# EAGLE board mainboard (EAGLE 7.4.0), part 1 of 2
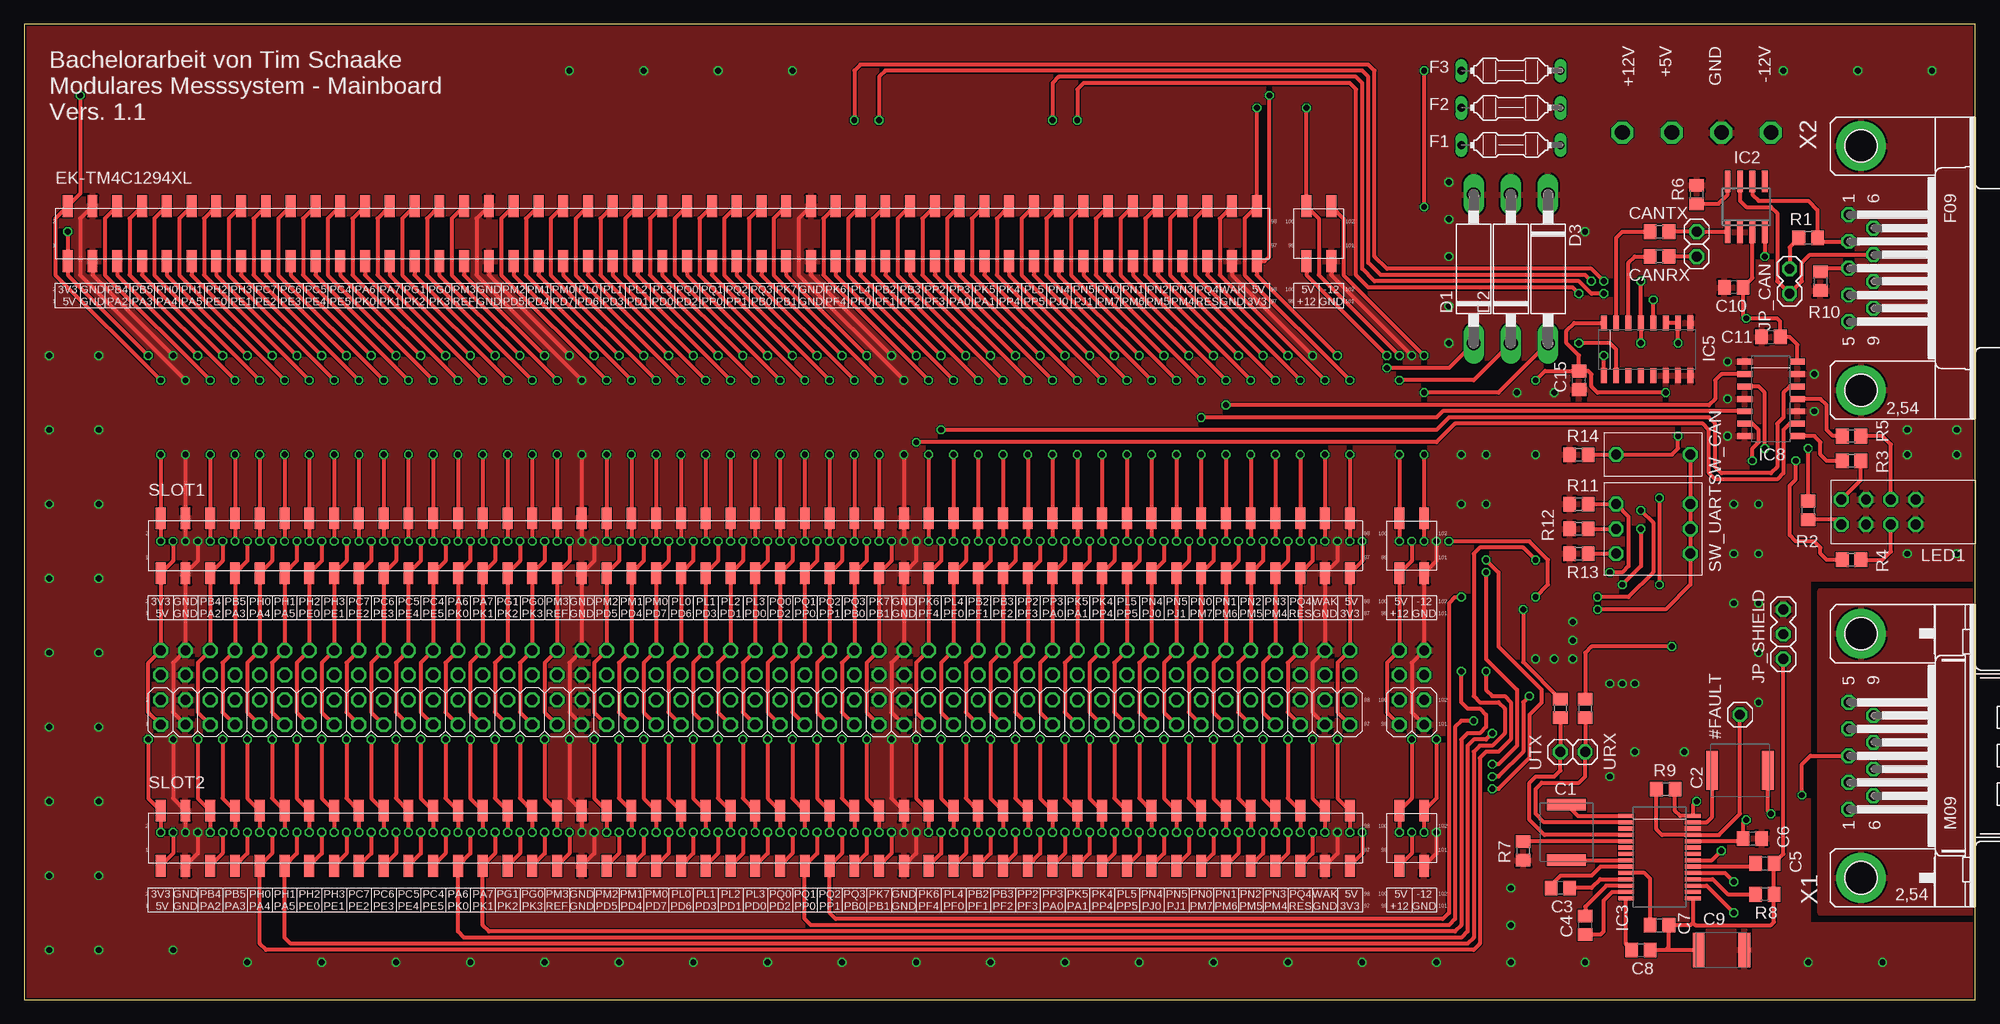
[diagram p5: board, top side]
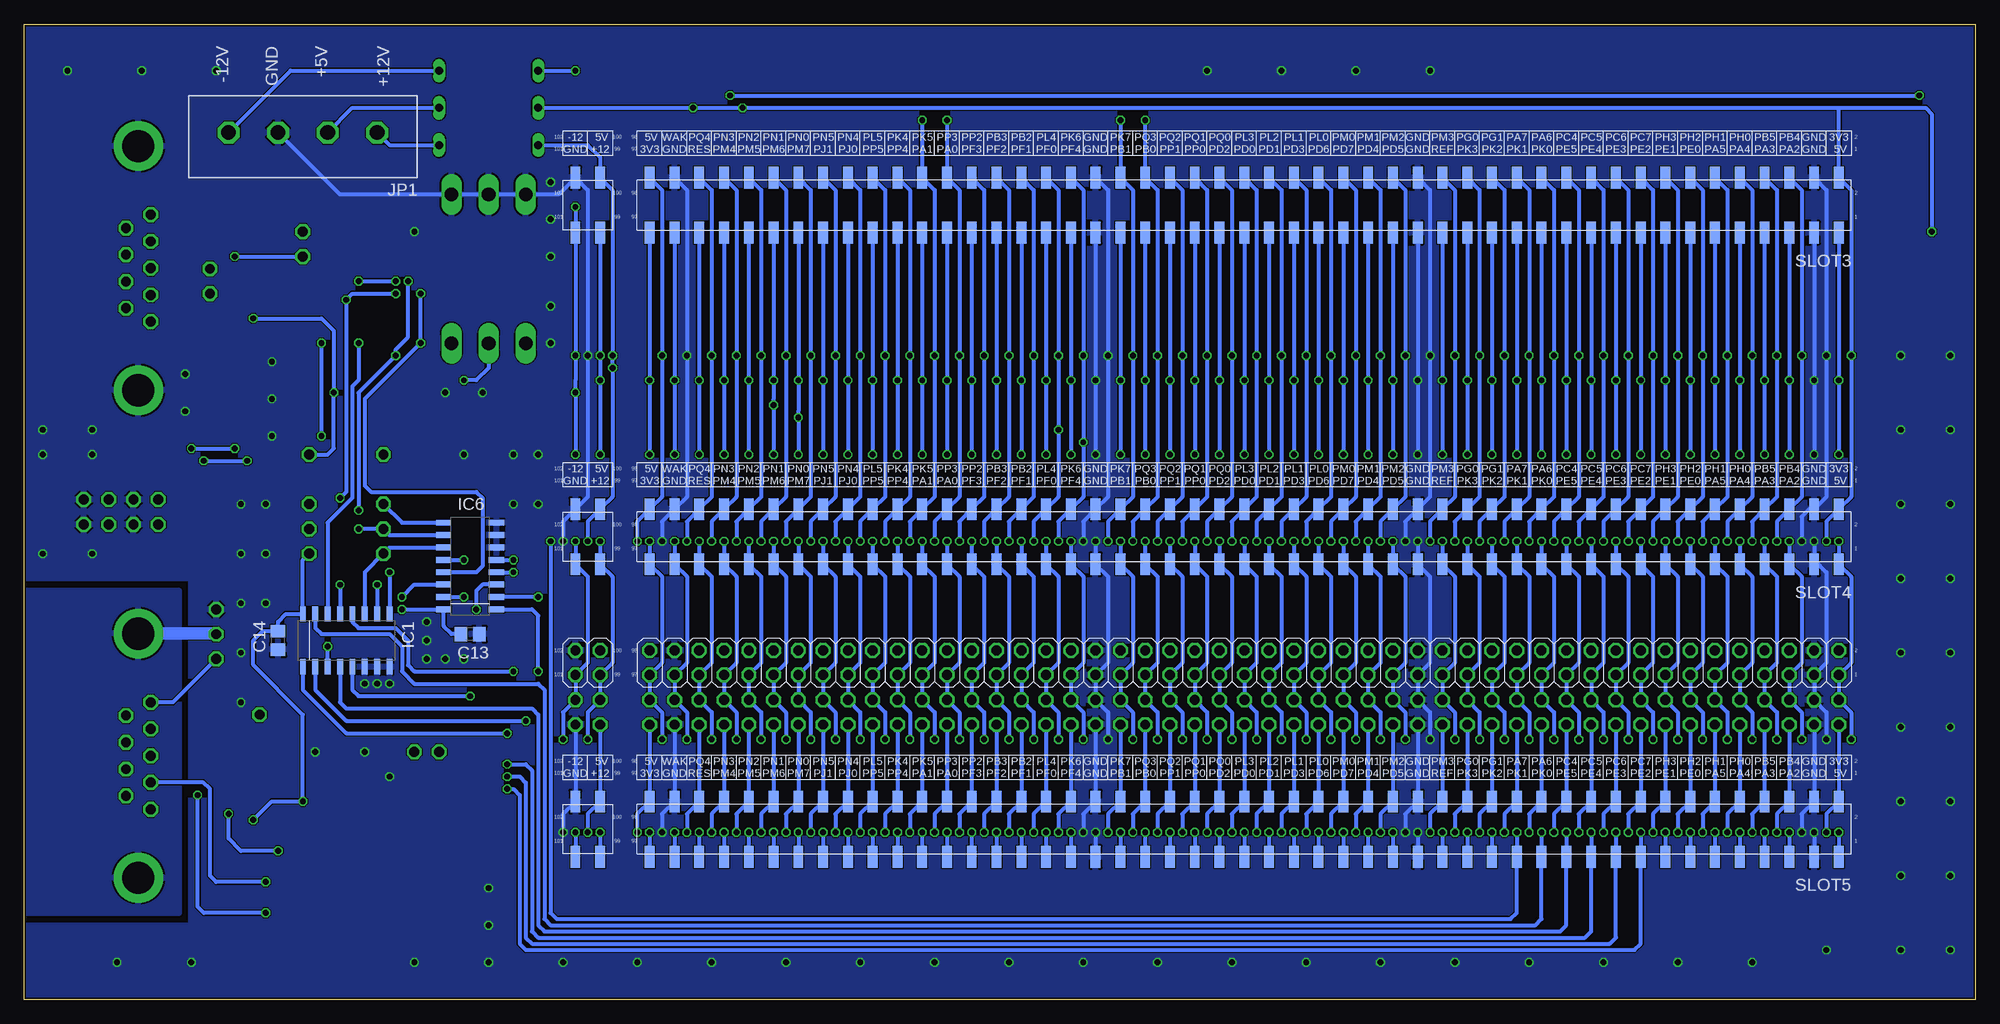
[diagram p6: board, bottom side, seen from below]

Size 200 x 100 mm. Coordinates in mm from the lower left corner, seen from the top.
Outline: 0,0 200,0 200,100 0,100 0,0
Copper layers (1*16): Top 0.018mm / dielectric 1.55mm / Bottom 0.018mm
Design rules "Multi-CB_2L_125um-Tracks_OL35um": minimum track width 0.125mm, minimum drill 0.2mm, track to track 0.125mm, track to pad 0.125mm, pad to pad 0.125mm, via to via 0.125mm, smd to smd 0mil, copper to edge 0.2mm, drill to drill 0.2mm, minimum pad ring 0.125mm, minimum via ring 0.125mm, stop-mask expansion 2mil, vias tented up to drill 0.45mm, thermal gap 0.2mm

## Footprints (pad centres in the part's own frame; a part is rotated, then mirrored left to right if it is on the bottom)
1X1 = drill 1.016 octagon: 1 0,0
C2220 = smd 1.2 x 4: 1 -2.85,0; 2 2.85,0
C0805 = smd 1.3 x 1.5: 1 -0.95,0; 2 0.95,0
C1812 = smd 1.2 x 3.5: 1 -2.35,0; 2 2.35,0
C1702-15 = drill 1.397 long: A 7.62,0; C -7.62,0
EK-TM4C1294XL_BB+SMD = smd 1.016 x 2.223: 1 -60.96,-2.826; 2 -60.96,2.826; 3 -58.42,-2.826; 4 -58.42,2.826; 5 -55.88,-2.826; 6 -55.88,2.826; 7 -53.34,-2.826; 8 -53.34,2.826; 9 -50.8,-2.826; 10 -50.8,2.826; 11 -48.26,-2.826; 12 -48.26,2.826; 13 -45.72,-2.826; 14 -45.72,2.826; 15 -43.18,-2.826; 16 -43.18,2.826; 17 -40.64,-2.826; 18 -40.64,2.826; 19 -38.1,-2.826; 20 -38.1,2.826; 21 -35.56,-2.826; 22 -35.56,2.826; 23 -33.02,-2.826; 24 -33.02,2.826; 25 -30.48,-2.826; 26 -30.48,2.826; 27 -27.94,-2.826; 28 -27.94,2.826; 29 -25.4,-2.826; 30 -25.4,2.826; 31 -22.86,-2.826; 32 -22.86,2.826; 33 -20.32,-2.826; 34 -20.32,2.826; 35 -17.78,-2.826; 36 -17.78,2.826; 37 -15.24,-2.826; 38 -15.24,2.826; 39 -12.7,-2.826; 40 -12.7,2.826; 41 -10.16,-2.826; 42 -10.16,2.826; 43 -7.62,-2.826; 44 -7.62,2.826; 45 -5.08,-2.826; 46 -5.08,2.826; 47 -2.54,-2.826; 48 -2.54,2.826; 49 0,-2.826; 50 0,2.826; 51 2.54,-2.826; 52 2.54,2.826; 53 5.08,-2.826; 54 5.08,2.826; 55 7.62,-2.826; 56 7.62,2.826; 57 10.16,-2.826; 58 10.16,2.826; 59 12.7,-2.826; 60 12.7,2.826; 61 15.24,-2.826; 62 15.24,2.826; 63 17.78,-2.826; 64 17.78,2.826; 65 20.32,-2.826; 66 20.32,2.826; 67 22.86,-2.826; 68 22.86,2.826; 69 25.4,-2.826; 70 25.4,2.826; 71 27.94,-2.826; 72 27.94,2.826; 73 30.48,-2.826; 74 30.48,2.826; 75 33.02,-2.826; 76 33.02,2.826; 77 35.56,-2.826; 78 35.56,2.826; 79 38.1,-2.826; 80 38.1,2.826; 81 40.64,-2.826; 82 40.64,2.826; 83 43.18,-2.826; 84 43.18,2.826; 85 45.72,-2.826; 86 45.72,2.826; 87 48.26,-2.826; 88 48.26,2.826; 89 50.8,-2.826; 90 50.8,2.826; 91 53.34,-2.826; 92 53.34,2.826; 93 55.88,-2.826; 94 55.88,2.826; 95 58.42,-2.826; 96 58.42,2.826; 97 60.96,-2.826; 98 60.96,2.826; 99 66.04,-2.826; 100 66.04,2.826; 101 68.58,-2.826; 102 68.58,2.826
PICOFUSE = drill 0.813 long: 1 -5.08,0; 2 5.08,0
SOIC16_D = smd 0.6 x 1.55: 1 -4.445,-2.7; 2 -3.175,-2.7; 3 -1.905,-2.7; 4 -0.635,-2.7; 5 0.635,-2.7; 6 1.905,-2.7; 7 3.175,-2.7; 8 4.445,-2.7; 9 4.445,2.7; 10 3.175,2.7; 11 1.905,2.7; 12 0.635,2.7; 13 -0.635,2.7; 14 -1.905,2.7; 15 -3.175,2.7; 16 -4.445,2.7
SO08 = smd 0.6 x 2.2: 1 -1.905,-2.6; 2 -0.635,-2.6; 3 0.635,-2.6; 4 1.905,-2.6; 5 1.905,2.6; 6 0.635,2.6; 7 -0.635,2.6; 8 -1.905,2.6
SSOP28_A28M-3 = smd 0.42 x 1.62: 1 -4.225,-3.425; 2 -3.575,-3.425; 3 -2.925,-3.425; 4 -2.275,-3.425; 5 -1.625,-3.425; 6 -0.975,-3.425; 7 -0.325,-3.425; 8 0.325,-3.425; 9 0.975,-3.425; 10 1.625,-3.425; 11 2.275,-3.425; 12 2.925,-3.425; 13 3.575,-3.425; 14 4.225,-3.425; 15 4.225,3.425; 16 3.575,3.425; 17 2.925,3.425; 18 2.275,3.425; 19 1.625,3.425; 20 0.975,3.425; 21 0.325,3.425; 22 -0.325,3.425; 23 -0.975,3.425; 24 -1.625,3.425; 25 -2.275,3.425; 26 -2.925,3.425; 27 -3.575,3.425; 28 -4.225,3.425
SOIC14_D = smd 0.6 x 1.55: 1 -3.81,-2.7; 2 -2.54,-2.7; 3 -1.27,-2.7; 4 0,-2.7; 5 1.27,-2.7; 6 2.54,-2.7; 7 3.81,-2.7; 8 3.81,2.7; 9 2.54,2.7; 10 1.27,2.7; 11 0,2.7; 12 -1.27,2.7; 13 -2.54,2.7; 14 -3.81,2.7
W1X4 = drill 1.5 octagon: 1 -7.62,0; 2 -2.54,0; 3 2.54,0; 4 7.62,0
1X2 = drill 1.016 octagon: 1 -1.27,0; 2 1.27,0
1X3 = drill 1.016 octagon: 1 -2.54,0; 2 0,0; 3 2.54,0
LED2X4 = drill 1.016 octagon: 1 -3.81,-1.27; 2 -3.81,1.27; 3 -1.27,-1.27; 4 -1.27,1.27; 5 1.27,-1.27; 6 1.27,1.27; 7 3.81,-1.27; 8 3.81,1.27
EK-TM4C1294XL_BB+ = drill 1.016 octagon: 1 -60.96,-1.27; 2 -60.96,1.27; 3 -58.42,-1.27; 4 -58.42,1.27; 5 -55.88,-1.27; 6 -55.88,1.27; 7 -53.34,-1.27; 8 -53.34,1.27; 9 -50.8,-1.27; 10 -50.8,1.27; 11 -48.26,-1.27; 12 -48.26,1.27; 13 -45.72,-1.27; 14 -45.72,1.27; 15 -43.18,-1.27; 16 -43.18,1.27; 17 -40.64,-1.27; 18 -40.64,1.27; 19 -38.1,-1.27; 20 -38.1,1.27; 21 -35.56,-1.27; 22 -35.56,1.27; 23 -33.02,-1.27; 24 -33.02,1.27; 25 -30.48,-1.27; 26 -30.48,1.27; 27 -27.94,-1.27; 28 -27.94,1.27; 29 -25.4,-1.27; 30 -25.4,1.27; 31 -22.86,-1.27; 32 -22.86,1.27; 33 -20.32,-1.27; 34 -20.32,1.27; 35 -17.78,-1.27; 36 -17.78,1.27; 37 -15.24,-1.27; 38 -15.24,1.27; 39 -12.7,-1.27; 40 -12.7,1.27; 41 -10.16,-1.27; 42 -10.16,1.27; 43 -7.62,-1.27; 44 -7.62,1.27; 45 -5.08,-1.27; 46 -5.08,1.27; 47 -2.54,-1.27; 48 -2.54,1.27; 49 0,-1.27; 50 0,1.27; 51 2.54,-1.27; 52 2.54,1.27; 53 5.08,-1.27; 54 5.08,1.27; 55 7.62,-1.27; 56 7.62,1.27; 57 10.16,-1.27; 58 10.16,1.27; 59 12.7,-1.27; 60 12.7,1.27; 61 15.24,-1.27; 62 15.24,1.27; 63 17.78,-1.27; 64 17.78,1.27; 65 20.32,-1.27; 66 20.32,1.27; 67 22.86,-1.27; 68 22.86,1.27; 69 25.4,-1.27; 70 25.4,1.27; 71 27.94,-1.27; 72 27.94,1.27; 73 30.48,-1.27; 74 30.48,1.27; 75 33.02,-1.27; 76 33.02,1.27; 77 35.56,-1.27; 78 35.56,1.27; 79 38.1,-1.27; 80 38.1,1.27; 81 40.64,-1.27; 82 40.64,1.27; 83 43.18,-1.27; 84 43.18,1.27; 85 45.72,-1.27; 86 45.72,1.27; 87 48.26,-1.27; 88 48.26,1.27; 89 50.8,-1.27; 90 50.8,1.27; 91 53.34,-1.27; 92 53.34,1.27; 93 55.88,-1.27; 94 55.88,1.27; 95 58.42,-1.27; 96 58.42,1.27; 97 60.96,-1.27; 98 60.96,1.27; 99 66.04,-1.27; 100 66.04,1.27; 101 68.58,-1.27; 102 68.58,1.27
R0805 = smd 1.3 x 1.5: 1 -0.95,0; 2 0.95,0
NT01 = drill 1.016 octagon: 1 0,-3.81; 2 0,3.81
NT03 = drill 1.016 octagon: 1 -2.54,-3.81; 2 -2.54,3.81; 3 0,-3.81; 4 0,3.81; 5 2.54,-3.81; 6 2.54,3.81
M09HP = drill 1.016 octagon: 1 -5.486,1.27; 2 -2.743,1.27; 3 0,1.27; 4 2.743,1.27; 5 5.486,1.27; 6 -4.115,-1.27; 7 -1.372,-1.27; 8 1.372,-1.27; 9 4.115,-1.27 | drill 3.302 pad 5.08: G1 -12.522,0; G2 12.522,0
F09HP = drill 1.016 octagon: 1 -5.486,-1.27; 2 -2.743,-1.27; 3 0,-1.27; 4 2.743,-1.27; 5 5.486,-1.27; 6 -4.115,1.27; 7 -1.372,1.27; 8 1.372,1.27; 9 4.115,1.27 | drill 3.302 pad 5.08: G1 -12.522,0; G2 12.522,0

## Placement (x,y rotation side)
#FAULT  [1X1]  175.9,29.21 0 top
C1  47n  [C2220]  158.12,17.14 90 top
C2  47n  [C2220]  175.9,23.5 180 top
C3  100n  [C0805]  157.48,11.43 180 top
C4  470n  [C0805]  160.02,7.62 90 top
C5  1µ  [C0805]  177.16,16.51 0 top
C6  2µ2  [C0805]  178.44,13.97 0 top
C7  470n  [C0805]  167.64,7.62 0 top
C8  470n  [C0805]  165.74,5.08 0 top
C9  10n  [C1812]  173.99,5.08 0 top
C10  100n  [C0805]  175.26,73.03 180 top
C11  100n  [C0805]  179.07,67.94 0 top
C13  100n  [C0805]  154.31,37.47 180 bottom
C14  100n  [C0805]  173.99,36.83 90 bottom
C15  100n  [C0805]  159.38,63.5 90 top
CANRX  [1X1]  171.45,76.2 90 top
CANTX  [1X1]  171.45,78.74 0 top
D1  1N5352  [C1702-15]  148.59,74.93 90 top
D2  1N5341  [C1702-15]  152.4,74.93 90 top
D3  1N5352  [C1702-15]  156.21,74.93 270 top
EK-TM4C1294XL  EK-TM4C1294XL_BB+SMD  [EK-TM4C1294XL_BB+SMD]  65.41,78.54 0 top
F1  FUSEPICOFUSE  [PICOFUSE]  152.4,87.63 180 top
F2  FUSEPICOFUSE  [PICOFUSE]  152.4,91.44 180 top
F3  FUSEPICOFUSE  [PICOFUSE]  152.4,95.25 180 top
IC1  CD74HC4051M96  [SOIC16_D]  167,36.83 0 bottom
IC2  MCP2551-I/SN  [SO08]  176.53,81.28 0 top
IC3  MAX3250  [SSOP28_A28M-3]  167.64,14.61 270 top
IC5  CD74HC4053M96  [SOIC16_D]  166.37,66.67 0 top
IC6  CD74HC4051M96  [SOIC16_D]  154.31,44.45 90 bottom
IC8  SN74HCT125D  [SOIC14_D]  179.07,61.59 270 top
JP1  W1X4  [W1X4]  171.45,88.9 180 bottom
JP_CAN  [1X2]  180.97,73.66 270 top
JP_SHIELD  [1X3]  180.34,37.47 270 top
LED1  LED2X4  [LED2X4]  190.09,50 180 top
PINH1  EK-TM4C1294XL_BB+  [EK-TM4C1294XL_BB+]  74.93,29.46 0 top
PINH2  EK-TM4C1294XL_BB+  [EK-TM4C1294XL_BB+]  74.93,34.54 180 bottom
R1  120  [R0805]  182.88,78.11 0 top
R2  270  [R0805]  182.88,50.16 270 top
R3  270  [R0805]  187.32,55.24 0 top
R4  270  [R0805]  187.32,45.09 0 top
R5  270  [R0805]  187.32,57.78 0 top
R6  0  [R0805]  171.45,82.55 90 top
R7  1k  [R0805]  153.67,15.24 270 top
R8  1k  [R0805]  178.44,10.79 180 top
R9  10k  [R0805]  168.28,21.59 0 top
R10  0  [R0805]  184.15,73.66 90 top
R11  10k  [R0805]  159.38,50.8 0 top
R12  10k  [R0805]  159.38,48.26 0 top
R13  10k  [R0805]  159.38,45.72 0 top
R14  10k  [R0805]  159.38,55.88 0 top
R15  0  [R0805]  160.02,29.84 270 top
R16  0  [R0805]  157.48,29.84 270 top
R17  0  [R0805]  167.64,78.74 0 top
R18  0  [R0805]  167.64,76.2 180 top
SLOT1  EK-TM4C1294XL_BB+SMD  [EK-TM4C1294XL_BB+SMD]  74.93,46.54 0 top
SLOT2  EK-TM4C1294XL_BB+SMD  [EK-TM4C1294XL_BB+SMD]  74.93,16.54 0 top
SLOT3  EK-TM4C1294XL_BB+SMD  [EK-TM4C1294XL_BB+SMD]  74.93,81.46 180 bottom
SLOT4  EK-TM4C1294XL_BB+SMD  [EK-TM4C1294XL_BB+SMD]  74.93,47.46 180 bottom
SLOT5  EK-TM4C1294XL_BB+SMD  [EK-TM4C1294XL_BB+SMD]  74.93,17.46 180 bottom
SW_CAN  [NT01]  167,55.88 90 top
SW_UART  [NT03]  167,48.26 90 top
URX  [1X1]  160.02,25.4 90 top
UTX  [1X1]  157.48,25.4 90 top
X1  [M09HP]  188.32,25 90 top
X2  [F09HP]  188.32,75 270 top